# Altium schematic sheet Radio_Module.SchDoc
size A
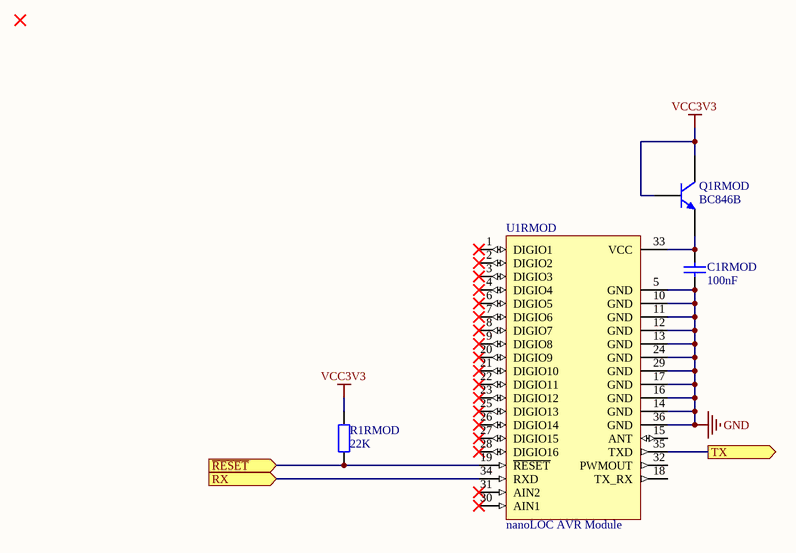
[diagram p0: Radio_Module.SchDoc]

## Parts
C1RMOD  value 100nF  [CC1608-0603]  (hidden comment: Cap)
Q1RMOD  BC846B  [SO-G3]
R1RMOD  value 22K  [CR1608-0603]  (hidden comment: Res)
U1RMOD  nanoLOC AVR Module  [nano_LOC_AVR_Module35x14]

## Ports
RX (in), TX (out), ~{RESET} (in)

## Nets
GND: C1RMOD.1 U1RMOD.5(GND) U1RMOD.10(GND) U1RMOD.11(GND) U1RMOD.12(GND) U1RMOD.13(GND) U1RMOD.14(GND) U1RMOD.16(GND) U1RMOD.17(GND) U1RMOD.24(GND) U1RMOD.29(GND) U1RMOD.36(GND)
VCC3V3: Q1RMOD.1(B) Q1RMOD.3(C) R1RMOD.2
~{RESET}: R1RMOD.1 U1RMOD.19(~{RESET}) ; port ~{RESET}
RX: U1RMOD.34(RXD) ; port RX
TX: U1RMOD.35(TXD) ; port TX
NetC1RMOD_2: C1RMOD.2 Q1RMOD.2(E) U1RMOD.33(VCC)

Not connected (* = marked no-connect by the designer): U1RMOD 1(DIGIO1)* 2(DIGIO2)* 3(DIGIO3)* 4(DIGIO4)* 6(DIGIO5)* 7(DIGIO6)* 8(DIGIO7)* 9(DIGIO8)* 15(ANT) 18(TX_RX) 20(DIGIO9)* 21(DIGIO10)* 22(DIGIO11)* 23(DIGIO12)* 25(DIGIO13)* 26(DIGIO14)* 27(DIGIO15)* 28(DIGIO16)* 30(AIN1)* 31(AIN2)* 32(PWMOUT)

## Library data of the parts
C1RMOD = Cap: Capacitor
Q1RMOD = BC846B: NPN Bipolar Transistor; Manufacturer: NXP; OrderCode: BC846B T/R; Distributor: Digikey
R1RMOD = Res: Resistor; Distributor: Digikey
U1RMOD = nanoLOC AVR Module: Radio Transceiver and Localisation module; Manufacturer: NanoTron Inc.; Distributor: *; OrderCode: *